# Altium schematic sheet LTE_UART_USB_adapter.SchDoc
size Letter; SheetNumber: 4; SheetTotal: 5
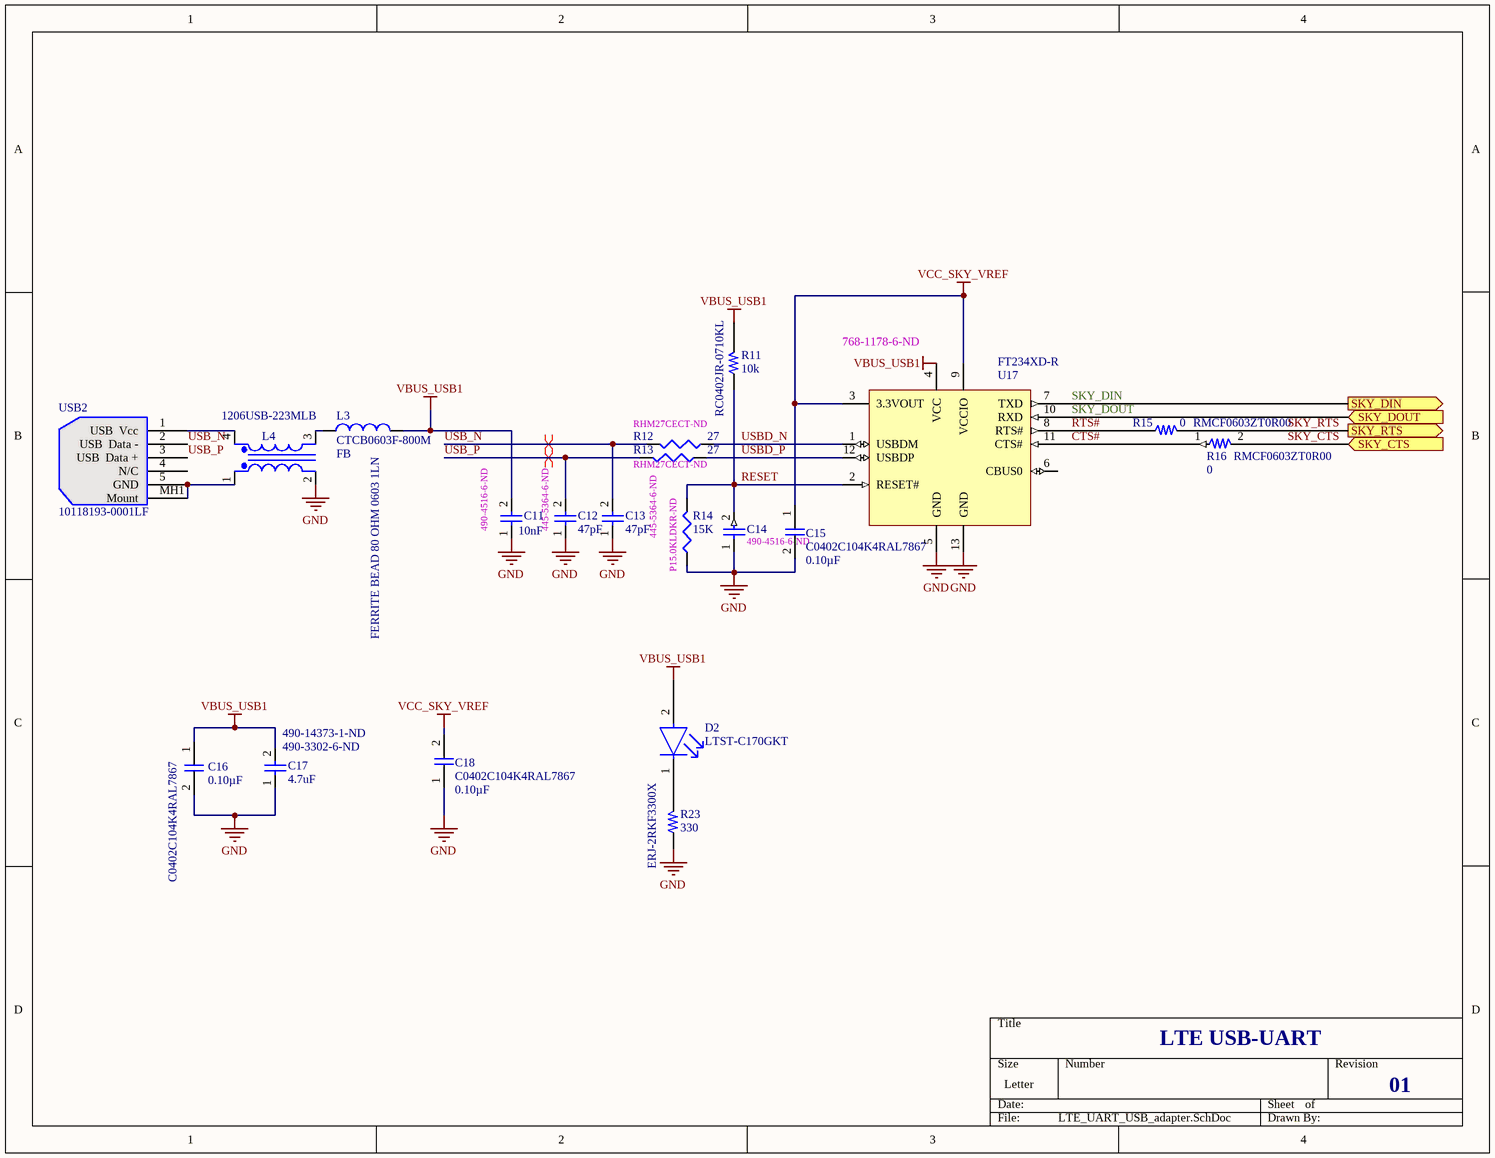
[diagram p0: LTE_UART_USB_adapter.SchDoc]

## Parts
C11  Capacitance: 10nF  Supplier Part Number 1: 490-4516-6-ND  [SMD CAP 1005]  (hidden comment: GRM155R71H103KA88D)
C12  Capacitance: 47pF  Supplier Part Number 1: 445-5364-6-ND  [SMD CAP 1005]  (hidden comment: C1005C0G1H470G050BA)
C13  Capacitance: 47pF  Supplier Part Number 1: 445-5364-6-ND  [SMD CAP 1005]  (hidden comment: C1005C0G1H470G050BA)
C14  Supplier Part Number 1: 490-4516-6-ND  [SMD CAP 1005]  (hidden comment: GRM155R71H103KA88D)
C15  C0402C104K4RAL7867  Capacitance: 0.10µF  [SMD CAP 1005]
C16  C0402C104K4RAL7867  Capacitance: 0.10µF  [SMD CAP 1005]
C17  Capacitance: 4.7uF  Supplier Part Number 1: 490-3302-6-ND  Supplier Part Number 2: 490-14373-1-ND  [CAPC1608M]  (hidden comment: GRM188R61A475KAAJD)
C18  C0402C104K4RAL7867  Capacitance: 0.10µF  [SMD CAP 1005]
D2  LTST-C170GKT  [FP-LTST-C170GKT-MFG]
L3  CTCB0603F-800M  value FB  Desc: FERRITE BEAD 80 OHM 0603 1LN  [INDC1608M]
L4  1206USB-223MLB  [1206USB-223MLB]
R11  Resistance_Ohms: 10k  [SMD RES 1005]  (hidden comment: RC0402JR-0710KL)
R12  value 27  Supplier Part Number 1: RHM27CECT-ND  [SMD RES 1005]  (hidden comment: MCR01MRTJ270)
R13  value 27  Supplier Part Number 1: RHM27CECT-ND  [SMD RES 1005]  (hidden comment: MCR01MRTJ270)
R14  value 15K  Supplier Part Number 1: P15.0KLDKR-ND  [SMD RES 1005]  (hidden comment: ERJ-2RKF1502X)
R15  Resistance: 0  [RESC1608M]  (hidden comment: RMCF0603ZT0R00)
R16  Resistance: 0  [RESC1608M]  (hidden comment: RMCF0603ZT0R00)
R23  ERJ-2RKF3300X  Resistance: 330  [SMD RES 1005]
U17  FT234XD-R  Supplier Part Number 1: 768-1178-6-ND  [DFN-12_V]
USB2  10118193-0001LF  [10118193-0001LF Rev01]

## Ports
SKY_CTS (in), SKY_DIN (out), SKY_DOUT (in), SKY_RTS (out)

## Nets
GND: C11.1 C12.1 C13.1 C14.1 C15.2 C16.2 C17.1 C18.1 L4.2(Pri-) R14.1 R23.1 U17.5(GND) U17.13(GND)
VBUS_USB1: C11.2 C16.1 C17.2 D2.2(A) L3.1 R11.2 U17.4(VCC)
VCC_SKY_VREF: C15.1 C18.2 U17.3(3.3VOUT) U17.9(VCCIO)
CTS#: R16.1 U17.11(CTS#)
RESET: C14.2 R11.1 R14.2 U17.2(RESET#)
RTS#: R15.1 U17.8(RTS#)
SKY_CTS: R16.2 ; port SKY_CTS
SKY_DIN: U17.7(TXD) ; port SKY_DIN
SKY_DOUT: U17.10(RXD) ; port SKY_DOUT
SKY_RTS: R15.2 ; port SKY_RTS
USB_N: C13.2 R12.2 USB2.2(USB__Data_-)
USB_P: C12.2 R13.2 USB2.3(USB__Data_+)
USBD_N: R12.1 U17.1(USBDM)
USBD_P: R13.1 U17.12(USBDP)
NetD2_1: D2.1(C) R23.2
NetL3_2: L3.2 L4.3(Sec-)
NetL4_1: L4.1(Pri+) USB2.5(GND) USB2.MH1(Mount)
NetL4_4: L4.4(Sec+) USB2.1(USB__Vcc)

Not connected (* = marked no-connect by the designer): U17 6(CBUS0); USB2 4(N/C)

## Layout directives
differential pair; rule Differential Pairs Routing [Pref Gap = 10mil    Min Gap  = 8mil    Max Gap  = 20milPref Width = 8mil    Min Width  = 7mil    Max Width  = 10mil]: USB_N, USB_P

## Notes on the sheet
- (near U17) 3
  **3.3VOUT
  POWEROutput
  3.3V output at 50mA. May be used to power VCCIO.
  When VCC is 3.3V; pin 3 is an input pin and should beconnected to pin 4.
- (near U17) 4 VCC POWER Input 5 V (or 3.3V) supply to IC
- 9 VCCIO
  POWER
  Input
  1.8V – 3.3V supply for the IO cells
- 7 TXD Output Transmit Asynchronous Data Output.
- (near U17) 1 USBDM INPUT/OUTPUT USB Data Signal Minus.
- (near U17) 12 USBDP INPUT/OUTPUT USB Data Signal Plus.
- 10 RXD Input Receiving Asynchronous Data Input.
- 8 RTS# Output Request to Send Control Output / Handshake Signal.
- 11 CTS# Input Clear To Send Control Input / Handshake Signal.
- (near U17) 2 RESET# INPUT Reset input (active low).
- (near U17) 5, 13 GND
  POWERInput
  0V Ground input.
- LTE USB-UART
- 01

## Library data of the parts
C11 = Cap Semi: 10000 pF ±10% 50V Ceramic Capacitor X7R 0402 (1005 Metric); Manufacturer: Murata Electronics North America; PackageReference: 0402; PackageDescription: Chip Capacitor; Digi-Key Part Number: 490-4516-1-ND; Manufacturer Product Number: GRM155R71H103KA88D; Footprint: 0402 (1005 Metric); Cost: 0.02558; Supplier 1: Digi-Key
C12 C13 = Cap Semi: 47 pF ±2% 50V Ceramic Capacitor C0G, NP0 0402 (1005 Metric); Manufacturer: TDK Corporation; PackageReference: 0402; PackageDescription: Chip Capacitor; Digi-Key Part Number: 445-5364-1-ND; Manufacturer Product Number: C1005C0G1H470G050BA; Footprint: 0402 (1005 Metric); Cost: 0.02558; Supplier 1: Digi-Key
C14 = Cap Semi: 10000 pF ±10% 50V Ceramic Capacitor X7R 0402 (1005 Metric); Manufacturer: Murata Electronics North America; Capacitance: 10nF; PackageReference: 0402; PackageDescription: Chip Capacitor; Digi-Key Part Number: 490-4516-1-ND; Manufacturer Product Number: GRM155R71H103KA88D; Footprint: 0402 (1005 Metric); Cost: 0.02558; Supplier 1: Digi-Key
C15 C16 C18 = 1000742: 0.1 µF ±10% 16V Ceramic Capacitor X7R 0402 (1005 Metric); Manufacturer1: Kemet; Manufacturer_Part_Number1: C0402C104K4RALTU; Item_Phase: Production; Mounting_Type: Surface Mount; Operating_Temperature: -55°C ~ 125°C; Thickness_Max: 0.022" (0.55mm); Value: 0.1uF; Tolerance: ±10%; Applications: General Purpose; Population: *; Part_Number: 1000742; Part_Type: Capacitor; Revision: A; Distributor1: Digi-Key; Distributor_Part_Number1: 399-6342-1-ND; Specs_View: https://app.bom.com/a/YGZ57I1I1KJQDBOE?v=spec.summary; Bom_View: https://app.bom.com/a/YGZ57I1I1KJQDBOE?v=bom.indented; Sourcing_View: https://app.bom.com/a/YGZ57I1I1KJQDBOE?v=sourcing.relationships; Costing_View: https://app.bom.com/a/YGZ57I1I1KJQDBOE?v=costing.summary; Files_View: https://app.bom.com/a/YGZ57I1I1KJQDBOE?v=files.associations; Datasheet_Link: http://www.samsungsem.com/kr/support/product-search/mlcc/CL05B104KO5NNNC.jsp; Capacitor_Type: Ceramic; Package_Case: 0402 (1005 Metric); Size_Dimension: 0.039" L x 0.020" W (1.00mm x 0.50mm); Temperature_Coefficient: X7R; Voltage_Rating: 16V; Distributor2: Digi-Key; Distributor_Part_Number2: 1276-1001-1-ND; Manufacturer2: Samsung Electro-Mechanics America, Inc; Manufacturer_Part_Number2: CL05B104KO5NNNC; Digi-Key Part Number: 399-C0402C104K4RAL7867CT-ND; Manufacturer: KEMET; Manufacturer Product Number: C0402C104K4RAL7867
C17 = Cap Semi: 4.7 µF ±10% 10V Ceramic Capacitor X5R 0603 (1608 Metric); Manufacturer: Murata Electronics North America; PackageReference: 0402; PackageDescription: Chip Capacitor; Digi-Key Part Number: 490-14373-1-ND; Manufacturer Product Number: GRM188R61A475KAAJD; Footprint: 0603 (1608 Metric); Cost: 0.02558; Supplier 1: DigiKey; Supplier 2: Digi-Key
D2 = CMP-1674-00002-6: Green 569nm LED Indication - Discrete 2.1V 0805 (2012 Metric); Manufacturer: Lite-On Inc.; Lens Style: Diffused; Number of Elements: 1; Wavelength: 565nm; Luminous Intensity: 6mcd; Test Current: 10mA; Power Dissipation: 100mW; Reverse Voltage: 5V; Forward Current: 30mA; Lens Transparency: Clear; Viewing Angle: 130°; Lens Color: Colorless; Min Operating Temperature: -55°C; Dominant Wavelength: 569nm; Number of Pins: 2; Max Operating Temperature: 85°C; Forward Voltage: 2.1V; Color: Green; Radiation Hardening: No; Illumination Color: Green; Case Code (Metric): 2012; Case/Package: 0805; Width: 1.25mm; Case Code (Imperial): 0805; Package Quantity: 1; Height: 1.1mm; Depth: 1.25mm; Length: 2mm; Power Rating: 100mW; Lead Free: Lead Free; Number of LEDs: 1; Packaging: Tape and Reel; Mount: Surface Mount; Voltage: 5V; Digi-Key Part Number: 160-1179-1-ND; Manufacturer Product Number: LTST-C170GKT; Value: LED
L3 = Inductor: 80 Ohms @ 100 MHz 1 Ferrite Bead 0603 (1608 Metric) 600mA 100mOhm; Manufacturer: Central Technologies; Code_IEC: 1005; Published: 8-Jun-2000; LatestRevisionDate: 29-May-2009; LatestRevisionNote: IPC-7351 Footprint Added.; PackageReference: 0402-A; Publisher: Altium Limited; PackageDescription: Chip Inductor; Code_JEITA: 0402; Digi-Key Part Number: 4161-CTCB0603F-800M-ND; Manufacturer Product Number: CTCB0603F-800M; Cost: 0.02594; ComponentLink1Description: CIM10U800NC Datasheet; ComponentLink1URL: C:\Users\Roman.Chak\Documents\Projects\UVDI-360\Docs\Datasheets\Ferrite Bid\CIB_CIM10_ds.pdf; ComponentLink2Description: Datasheet; ComponentLink2URL: C:\Users\Roman.Chak\Documents\Projects\UVDI-360\Docs\Datasheets\Ferrite Bid\ctcbf-pwr.pdf
L4 = Trans Ideal: Common Mode Chokes / Filters; Manufacturer: Coilcraft; Published: 8-Jun-2000; LatestRevisionDate: 17-Jul-2002; LatestRevisionNote: Re-released for DXP Platform.; PackageReference: TRF_4; Publisher: Altium Limited; PackageDescription: Transformer; 4 Leads; Manufacturer Product Number: 1206USB-223MLB; ComponentLink1URL: C:\Users\chakr\OneDrive\Documents\Projects\WiFi Node Rev3.0-3.1-4.0\Docs\Datasheets\Firter Bid\DS_FT2232D.pdf; ComponentLink1Description: C Datasheet
R11 = 1000795: 10 kOhms ±5% 0.063W, 1/16W Chip Resistor 0402 (1005 Metric) Moisture Resistant Thick Film; Manufacturer1: Bourns Inc; Manufacturer_Part_Number1: CR0402-FX-1002GLF; Manufacturer: YAGEO; Item_Phase: Production; Mounting_Type: Surface Mount; Number_of_Terminations: 2; Operating_Temperature: -55°C ~ 155°C; Temperature_Coefficient: ±100ppm/°C; Tolerance: ±1%; Part_Number: RC0402JR-0710KL; Part_Type: Resistor; Revision: A; Distributor1: Digi-Key; Distributor_Part_Number1: CR0402-FX-1002GLFTR-ND; Manufacturer2: Bourns Inc; Manufacturer_Part_Number2: CR0402-FX-1002GAS; Distributor2: Digi-Key; Distributor_Part_Number2: CR0402-FX-1002GASTR-ND; Specs_View: https://app.bom.com/a/P7QWY9S9SBAH42BP?v=spec.summary; Bom_View: https://app.bom.com/a/P7QWY9S9SBAH42BP?v=bom.indented; Sourcing_View: https://app.bom.com/a/P7QWY9S9SBAH42BP?v=sourcing.relationships; Costing_View: https://app.bom.com/a/P7QWY9S9SBAH42BP?v=costing.summary; Files_View: https://app.bom.com/a/P7QWY9S9SBAH42BP?v=files.associations; Composition: Thick Film; Datasheet_Link: http://media.digikey.com/pdf/Data%20Sheets/Samsung%20PDFs/RC_Series_ds.pdf; Features: Moisture Resistant; Height: 0.016" (0.40mm); Power: 0.063W, 1/16W; Resistor_Package: 0402 (1005 Metric); Size_Dimension: 0.039" L x 0.020" W (1.00mm x 0.50mm); Digi-Key Part Number: 311-10KJRCT-ND; Manufacturer Product Number: RC0402JR-0710KL
R12 R13 = Res3: RES SMD 27 OHM 5% 1/16W 0402; Manufacturer: Rohm Semiconductor; Published: 8-Jun-2000; LatestRevisionDate: 29-May-2009; LatestRevisionNote: IPC-7351 Footprint Added.; PackageReference: J1-0603; Publisher: Altium Limited; PackageDescription: Chip Resistor; Digi-Key Part Number: RHM27CECT-ND; Manufacturer Part Number: MCR01MRTJ270; Cost: 0.00384; Supplier 1: Digi-Key
R14 = Res3: RES SMD 15K OHM 1% 1/10W 0402; Manufacturer: Panasonic Electronic Components; Published: 8-Jun-2000; LatestRevisionDate: 29-May-2009; LatestRevisionNote: IPC-7351 Footprint Added.; PackageReference: J1-0603; Publisher: Altium Limited; PackageDescription: Chip Resistor; Digi-Key Part Number: P15.0KLCT-ND; Manufacturer Part Number: ERJ-2RKF1502X; Cost: 0.00384; Supplier 1: Digi-Key
R15 R16 = 1001176: 0 Ohms Jumper Chip Resistor 0603 (1608 Metric) Automotive AEC-Q200 Thick Film; Manufacturer1: Stackpole Electronics Inc; Item_Phase: Production; Mounting_Type: Surface Mount; Number_of_Terminations: 2; Operating_Temperature: -55°C ~ 125°C; Power: 0.25W, 1/4W; Resistor_Package: 0805 (2012 Metric); Temperature_Coefficient: ±100ppm/°C; Tolerance: ±1%; Part_Number: RMCF0603ZT0R00; Part_Type: Resistor; Revision: A; Distributor1: Digi-Key; Distributor_Part_Number1: RMCF0603ZT0R00CT-ND; Specs_View: https://app.bom.com/a/Q8RXZATATCBI53HK?v=spec.summary; Bom_View: https://app.bom.com/a/Q8RXZATATCBI53HK?v=bom.indented; Sourcing_View: https://app.bom.com/a/Q8RXZATATCBI53HK?v=sourcing.relationships; Costing_View: https://app.bom.com/a/Q8RXZATATCBI53HK?v=costing.summary; Files_View: https://app.bom.com/a/Q8RXZATATCBI53HK?v=files.associations; Composition: Thick Film; Datasheet_Link: http://industrial.panasonic.com/lecs/www-data/pdf/AOA0000/AOA0000CE3.pdf; Features: Automotive AEC-Q200, Current Sense; Height: 0.028" (0.70mm); Size_Dimension: 0.079" L x 0.049" W (2.00mm x 1.25mm); Digi-Key Part Number: RMCF0603ZT0R00CT-ND; Manufacturer: Stackpole Electronics Inc; Manufacturer Product Number: RMCF0603ZT0R00
R23 = 1001162: 330 Ohms ±1% 0.1W, 1/10W Chip Resistor 0402 (1005 Metric) Automotive AEC-Q200 Thick Film; Manufacturer1: Panasonic Electronic Components; Item_Phase: Production; Mounting_Type: Surface Mount; Number_of_Terminations: 2; Operating_Temperature: -55°C ~ 155°C; Temperature_Coefficient: ±100ppm/°C; Part_Number: 1001162; Part_Type: Resistor; Revision: A; Manufacturer_Part_Number1: ERJ-2RKF3300X; Distributor1: Digi-Key; Distributor_Part_Number1: P330LCT-ND; Specs_View: https://app.bom.com/a/1J28AL4L4NMTGF0H?v=spec.summary; Bom_View: https://app.bom.com/a/1J28AL4L4NMTGF0H?v=bom.indented; Sourcing_View: https://app.bom.com/a/1J28AL4L4NMTGF0H?v=sourcing.relationships; Costing_View: https://app.bom.com/a/1J28AL4L4NMTGF0H?v=costing.summary; Files_View: https://app.bom.com/a/1J28AL4L4NMTGF0H?v=files.associations; Composition: Thick Film; Datasheet_Link: http://industrial.panasonic.com/www-cgi/jvcr13pz.cgi?E+PZ+3+AOA0002+ERJ2RKF3300X+7+WW; Features: Automotive AEC-Q200; Height: 0.016" (0.40mm); Power: 0.1W, 1/10W; Resistor_Package: 0402 (1005 Metric); Size_Dimension: 0.039" L x 0.020" W (1.00mm x 0.50mm); Tolerance: ±1%; Digi-Key Part Number: P330LCT-ND; Manufacturer: Panasonic Electronic Components; Manufacturer Product Number: ERJ-2RKF3300X
U17 = CMP-0248-00027-1: IC USB SERIAL BASIC UART 12DFN; Manufacturer: FTDI, Future Technology Devices International Ltd; PackageReference: DFN-12; PackageVersion: Feb-13; DatasheetVersion: ver 1.1, Feb-2013; ComponentLink1URL: http://www.ftdichip.com/; PartNumber: FT234XD-R; ComponentLink2URL: http://www.ftdichip.com/Support/Documents/DataSheets/ICs/DS_FT234XD.pdf; ComponentLink1Description: Manufacturer URL; PackageDescription: 12-Pin Dual Flat No-Lead, 3 x 3 mm Body, 0.45 mm Pitch, Exposed Pad; ComponentLink2Description: Datasheet Link; Digi-Key Part Number: 768-1178-1-ND; Cost: 2.17; Supplier 1: Digi-Key; Manufacturer Part Number: FT234XD-R; ComponentLink3Description: Datasheet; ComponentLink3URL: C:\Users\Roman.Chak\Documents\Projects\UVDI-360\Docs\Datasheets\FTDI\DS_FT234XD.pdf
USB2 = USB mini: USB - micro B USB 2.0 Receptacle Connector 5 Position Surface Mount, Right Angle, Horizontal; Manufacturer: FCI; Loc: Vendor; Assembly Note: Install; Value: CONN USB MICRO B RECPT SMT R/A; Alternative: None; Protorype Price: 0.46000; Manufacturer Part Number: 10118193-0001LF; Type: SMD; Supplier 1: Digi-Key; Purchased by: Vendor; Price for 100: 0.30320; Cost: 0.25988; Supplier 2: Digi-Key; Digi-Key Part Number: 609-4616-1-ND; ComponentLink1URL: C:\Users\rchak\Documents\Projects\WiFi Node Rev2.0\Docs\Datasheets\USB\10118193.pdf; ComponentLink1Description: C datasheet; ComponentLink2URL: C:\Users\rchak\Documents\Projects\WiFi Node Rev2.0\Docs\Datasheets\USB; ComponentLink2Description: Folder